# Altium schematic sheet Output_Rele.SchDoc
size A4; DocumentNumber: 4; SheetNumber: 4; SheetTotal: 11
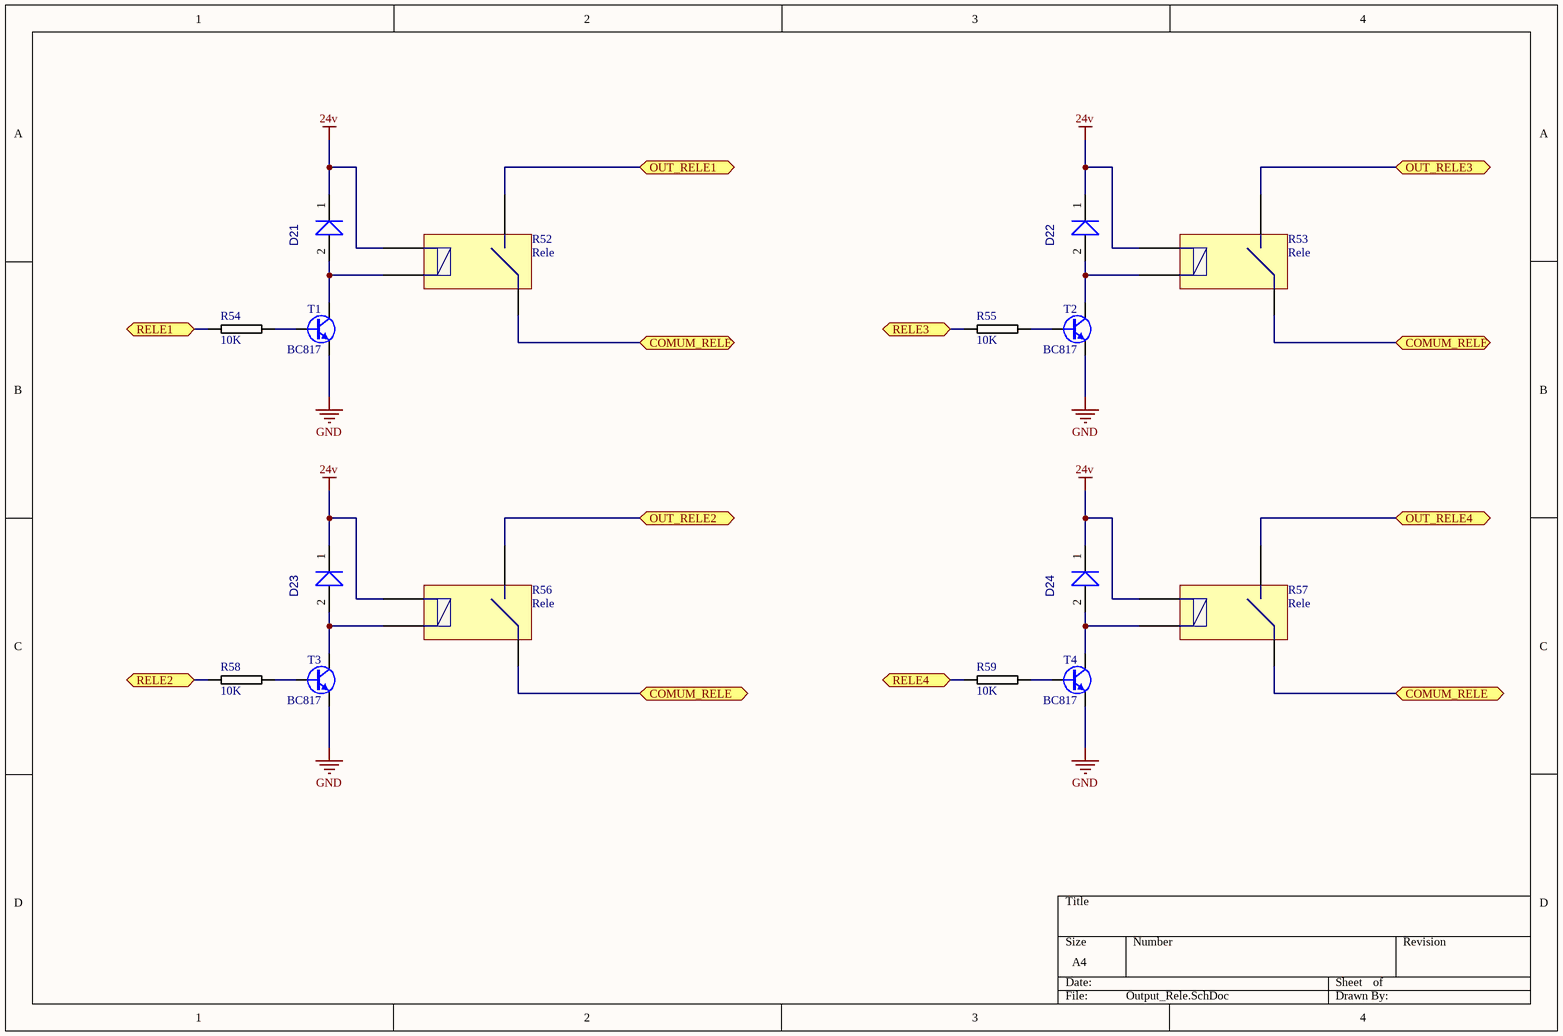
[diagram p0: Output_Rele.SchDoc]

## Parts
D21  DIODO 1N4007 PF-B1  [DIODO DO41 PF-B1]  (value not drawn)
D22  DIODO 1N4007 PF-B1  [DIODO DO41 PF-B1]  (value not drawn)
D23  DIODO 1N4007 PF-B1  [DIODO DO41 PF-B1]  (value not drawn)
D24  DIODO 1N4007 PF-B1  [DIODO DO41 PF-B1]  (value not drawn)
R52  Rele  [rele]
R53  Rele  [rele]
R54  10K  [0805R-10K]
R55  10K  [0805R-10K]
R56  Rele  [rele]
R57  Rele  [rele]
R58  10K  [0805R-10K]
R59  10K  [0805R-10K]
T1  BC817  [SOT95P230X110-3N]
T2  BC817  [SOT95P230X110-3N]
T3  BC817  [SOT95P230X110-3N]
T4  BC817  [SOT95P230X110-3N]

## Ports
COMUM_RELE, OUT_RELE1, OUT_RELE2, OUT_RELE3, OUT_RELE4, RELE1, RELE2, RELE3, RELE4

## Nets
24v: D21.1(K) D22.1(K) D23.1(K) D24.1(K) R52.1 R53.1 R56.1 R57.1
GND: T1.2(E) T2.2(E) T3.2(E) T4.2(E)
COMUM_RELE: R52.3 R53.3 R56.3 R57.3 ; port COMUM_RELE
OUT_RELE1: R52.4 ; port OUT_RELE1
OUT_RELE2: R56.4 ; port OUT_RELE2
OUT_RELE3: R53.4 ; port OUT_RELE3
OUT_RELE4: R57.4 ; port OUT_RELE4
RELE1: R54.1 ; port RELE1
RELE2: R58.1 ; port RELE2
RELE3: R55.1 ; port RELE3
RELE4: R59.1 ; port RELE4
NetD21_2: D21.2(A) R52.2 T1.3(C)
NetD22_2: D22.2(A) R53.2 T2.3(C)
NetD23_2: D23.2(A) R56.2 T3.3(C)
NetD24_2: D24.2(A) R57.2 T4.3(C)
NetR54_2: R54.2 T1.1(B)
NetR55_2: R55.2 T2.1(B)
NetR58_2: R58.2 T3.1(B)
NetR59_2: R59.2 T4.1(B)

## Library data of the parts
D21-D24 = DIODO 1N4007 PF-B1: cod: 606000120; Compra: 302003193; 3D comp: DIODO DO41 PF-B1; Descri: DIODO 1N4007 PF-B1; SCH: DIODO 1N4007 PF-B1
R54 R55 R58 R59 = 0805R-10K: RESISTOR 0805 1/4 WATT THIN FILM; Reel: *
T1-T4 = BC817: NPN Transistor; Part Description: 45V 500mA NPN General-Purpose Transistor; Manufacturer: NXP SEMICONDUCTORS; Table: Transistors; Part Number: BC817; Component Kind: Standard; Component Type: Standard; Device: BC817; PackageDescription: SOT23, 3 pin, Pitch 0.95mm - 1.3mm W X 2.9mm L X 1.1mm H, IPC Medium Density; Manufacturer Part Number: BC817; Pin Count: 3; Case: SOT23-3; Mounted: Yes; Socket: No; SMD: Yes; ComponentHeight: 1.1mm; HelpURL: \\cern.ch\dfs\Applications\Altium\Datasheets\BC817.pdf; Author: CERN DEM JLC; CreateDate: 12/05/2011; LatestRevisionDate: 12/05/2011